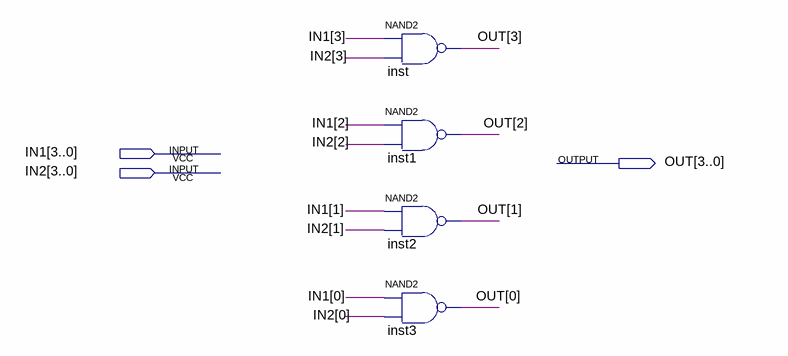
[diagram p0: schematic sheet]
// Quartus schematic 4bit.bdf as structural Verilog: 4 symbols, 3 pins
module \4bit  (
  input  [3:0] IN1,
  input  [3:0] IN2,
  output [3:0] OUT
);

  nand inst (OUT[3], IN1[3], IN2[3]);
  nand inst1 (OUT[2], IN1[2], IN2[2]);
  nand inst2 (OUT[1], IN1[1], IN2[1]);
  nand inst3 (OUT[0], IN1[0], IN2[0]);
endmodule
